# EasyEDA Pro project 学期项目.epro, board PCB1_1
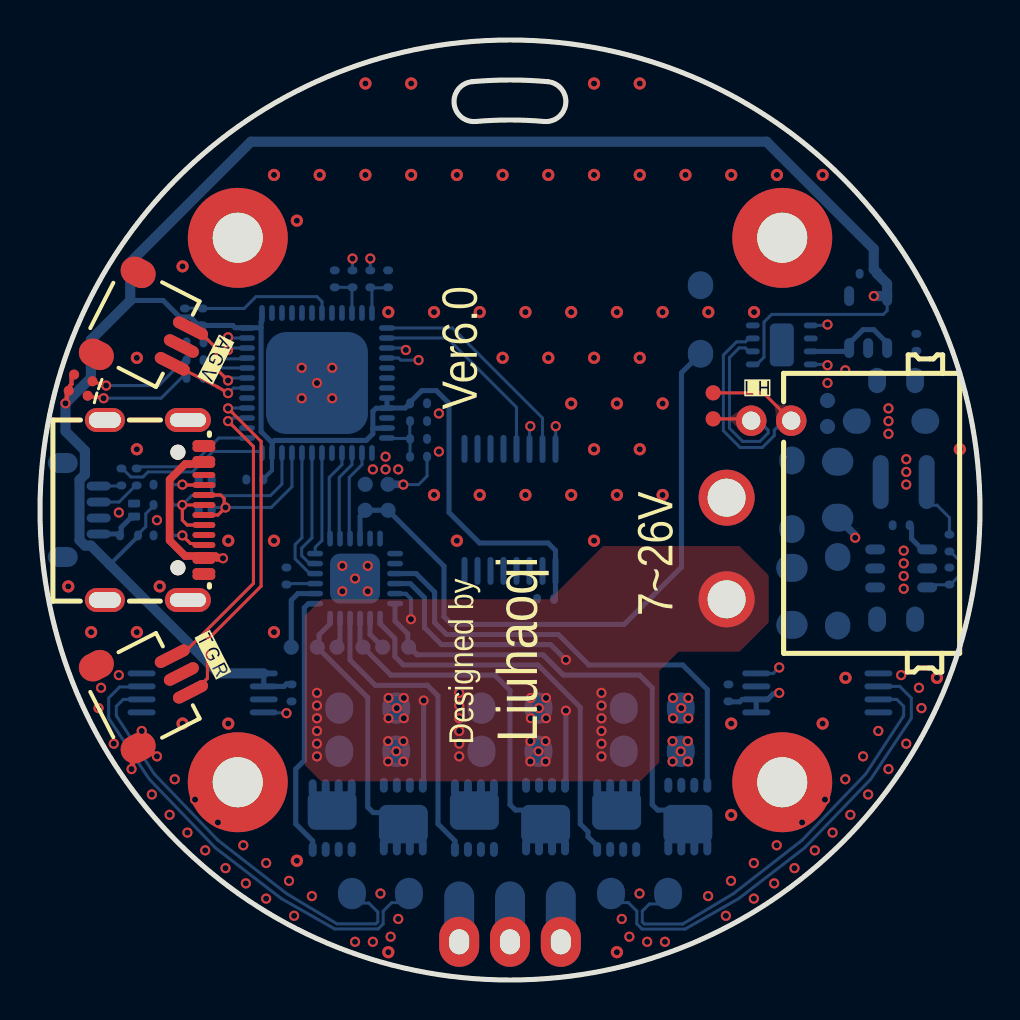
[diagram p13: board, top side]
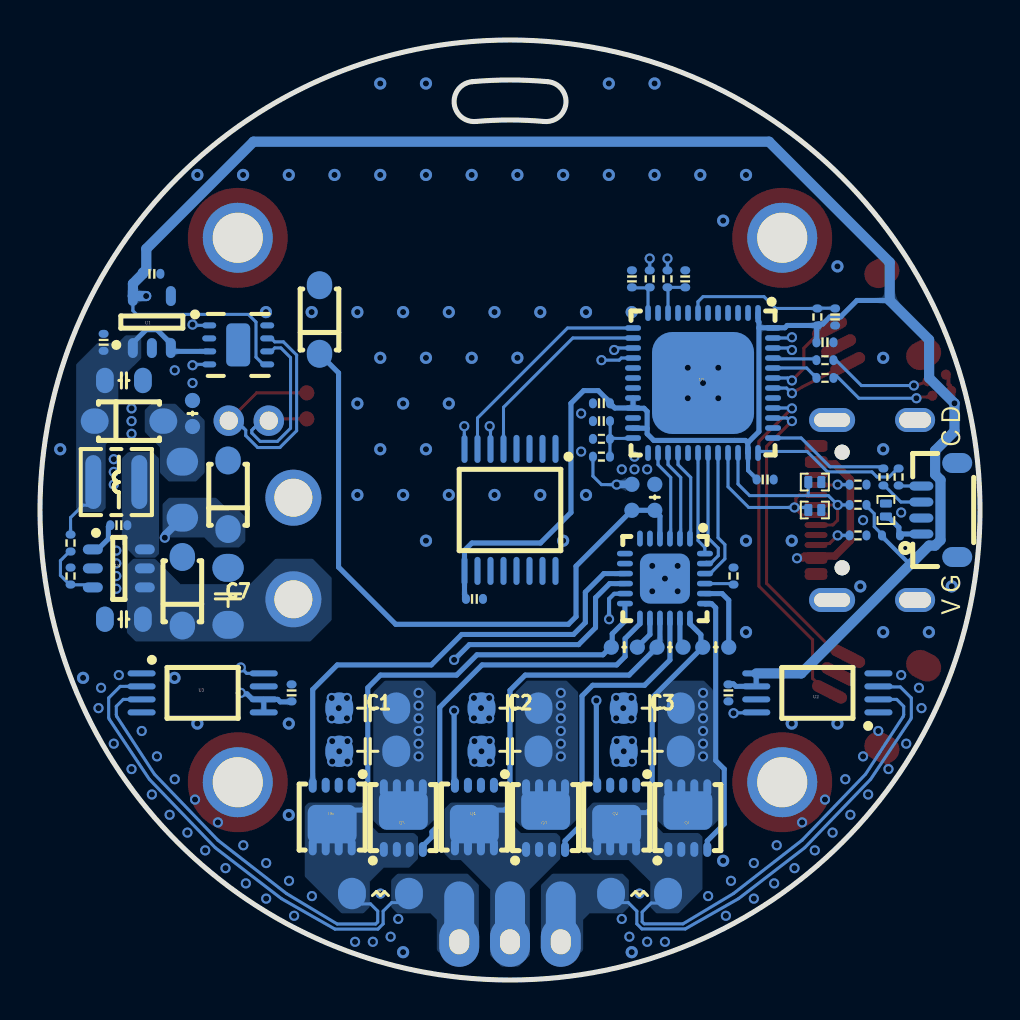
[diagram p14: board, bottom side, seen from below]

Outline 47 x 47 mm; copper layers: Top Layer, PowerAndSingle, Ground, Bottom Layer. Coordinates in mm from the lower left corner of the outline.
Outline path: circle c23.5,23.5 r23.5 ; 21.63,44.92 arc(23.5,45) 25.37,44.92 arc(26.3,43.83) 25.2,42.93 arc(23.5,43) 21.8,42.93 arc(20.7,43.83) 21.63,44.92
Stack: Top Layer 0.035mm / Dielectric 2 0.0994mm PP-006 er 4.1 / PowerAndSingle 0.0152mm / Dielectric 1 0.7mm FR-4 er 4.8 / Ground 0.0152mm / Dielectric 3 0.0994mm PP-006 er 4.1 / Bottom Layer 0.035mm

## Design rules (mm)
net VBAT: POWER
net +5: POWER
net +3.3: POWER
net VBUS: POWER
spacing Clearance (default): track to track 0.102, other pairs 0.102 to 0.3
track width Width (default): min 0.102, default 0.254, max 7.62
differential pair DiffPairsRouting (default): width min 0.102, default 0.152, max 0.381; gap min 0.102, default 0.152

## Placement (name value [footprint] x y rotation side)
C1  22UF@35V  [C1206_NS]  30.61 13.59 0 bottom
C2  22UF@35V  [C1206_NS]  23.5 13.59 0 bottom
C3  22UF@35V  [C1206_NS]  16.39 13.59 0 bottom
C4  22UF@35V  [C1206_NS]  30.61 11.44 0 bottom
C5  22UF@35V  [C1206_NS]  16.39 11.44 0 bottom
C6  22UF@35V  [C1206_NS]  23.5 11.44 0 bottom
C7  22UF@35V  [C1206_NS]  37.6 19.18 90 bottom
C8  1UF  [C0402_NS]  43.82 31.88 270 bottom
C9  1UF  [C0402_NS]  41.41 35.31 0 bottom
C10  0.1UF  [C0402_NS]  12.58 14.36 90 bottom
C11  0.1UF  [C0402_NS]  34.42 14.36 270 bottom
C12  1UF  [C0603_NS]  13.21 16.64 180 bottom
C13  0.1UF  [C0402_NS]  43.06 22.74 180 bottom
C14  10UF  [C0805_NS]  42.8 29.98 0 bottom
C15  4.7UF@35V  [C0805_NS]  42.8 18.04 180 bottom
C16  10UF@25V  [C0603_NS]  16.26 24.13 270 bottom
C17  0.1UF  [C0402_NS]  10.74 25.02 180 bottom
C18  1UF  [C0603_NS]  15.5 16.64 180 bottom
C19  0.1UF  [C0402_NS]  7.75 31.88 180 bottom
C20  0.1UF  [C0402_NS]  18.93 28.83 0 bottom
C21  0.1UF  [C0402_NS]  14.74 35.06 270 bottom
C22  0.1UF  [C0402_NS]  18.93 27.94 0 bottom
C23  0.1UF  [C0402_NS]  17.4 35.06 90 bottom
C24  1UF  [C0603_NS]  17.78 16.64 180 bottom
C25  0.1UF  [C0402_NS]  7.24 33.15 90 bottom
C26  1UF  [C0603_NS]  39.38 28.33 270 bottom
C27  0.1UF  [C0402_NS]  25.28 19.05 0 bottom
D1  SMF26A  [SOD-123]  39.88 19.44 270 bottom
D2  MM1Z20  [SOD-123]  33.03 33.02 270 bottom
D3  PESD5V0F1BL  [DFN1006-2L_L1.0_W0.6_P0.7]  4.7 23.5 90 bottom
D4  K24  [SOD-123]  42.55 27.94 0 bottom
D5  SMF6CA  [SOD-123]  37.6 24.26 270 bottom
D6  PESD5V0F1BL  [DFN1006-2L_L1.0_W0.6_P0.7]  8.26 23.5 180 bottom
D7  PESD5V0F1BL  [DFN1006-2L_L1.0_W0.6_P0.7]  8.26 24.9 180 bottom
JP1  CON-3P  [SH1.0-WT-3P]  5.47 14.48 297 top
JP2  CON-3P  [SH1.0-WT-3P]  5.47 32.52 243 top
JP3  CON-4P  [HC0.8-WT-4P]  2.04 23.5 90 bottom
L1  10uH  [NR3015]  43.19 24.9 0 bottom
L2  22nH@0.5A  [L0402_NS]  4.45 22.23 180 bottom
L3  1uH@1A  [L1206_NS]  39.88 24.52 90 bottom
LED1  绿色  [LED0402_NS]  2.16 30.1 340 top
LED2  红色  [LED0402_NS]  1.91 29.34 345 top
NOREF  -  [Pad_e57]  23.5 3.18 0 top
NOREF#2  -  [Pad_e63]  37.11 37.11 180 top
NOREF#3  -  [Pad_e55]  26.04 3.18 0 top
NOREF#4  -  [Pad_e64]  9.89 37.11 270 top
NOREF#5  -  [Pad_e58]  37.11 9.89 90 top
NOREF#6  -  [Pad_e62]  9.89 9.89 0 top
NOREF#7  -  [Pad_e66]  26.04 1.91 0 top
NOREF#8  -  [Pad_e68]  23.5 1.91 0 top
NOREF#9  -  [Pad_e59]  9.89 9.89 0 top
NOREF#10  -  [Pad_e61]  37.11 37.11 180 top
NOREF#11  -  [Pad_e67]  20.96 1.91 0 top
NOREF#12  -  [Pad_e60]  9.89 37.11 270 top
NOREF#13  -  [Pad_e56]  20.96 3.18 0 top
NOREF#14  -  [Pad_e65]  37.11 9.89 90 top
P1  XT30(2+2)  [XT30(2+2)PW-M]  35.95 23.5 90 top
Q1  AON7544  [DFN8_L3.3_W3.3_P0.65]  14.61 8.13 180 bottom
Q2  AON7544  [DFN8_L3.3_W3.3_P0.65]  18.17 8.13 0 bottom
Q3  AON7544  [DFN8_L3.3_W3.3_P0.65]  21.72 8.13 180 bottom
Q4  AON7544  [DFN8_L3.3_W3.3_P0.65]  25.28 8.13 0 bottom
Q5  AON7544  [DFN8_L3.3_W3.3_P0.65]  28.83 8.13 180 bottom
Q6  AON7544  [DFN8_L3.3_W3.3_P0.65]  32.39 8.13 0 bottom
R1  50mR  [R1206_NS]  17.02 4.32 0 bottom
R2  50mR  [R1206_NS]  29.98 4.32 0 bottom
R3  40K/NC  [R0402_NS]  12.32 20.2 90 bottom
R4  120R/NC  [R0603_NS]  33.66 28.71 90 top
R5  2K  [R0402_NS]  45.47 20.2 90 bottom
R6  10K  [R0402_NS]  45.47 21.85 270 bottom
R7  510R  [R0603_NS]  17.4 24.13 270 bottom
R8  75K  [R0402_NS]  18.93 26.17 0 bottom
R9  100R  [R0402_NS]  15.63 35.06 90 bottom
R10  10K  [R0402_NS]  18.93 27.06 180 bottom
R11  100R  [R0402_NS]  16.52 35.06 90 bottom
R12  10K  [R0402_NS]  8.13 33.15 270 bottom
R13  5.1K  [R0402_NS]  7.75 30.99 180 bottom
R14  2K  [R0402_NS]  7.75 30.1 180 bottom
R15  100R  [R0402_NS]  4.83 25.15 270 bottom
R16  100R  [R0402_NS]  4.07 25.15 270 bottom
R17  5.1K  [R0402_NS]  6.1 24.77 0 bottom
R18  5.1K  [R0402_NS]  6.1 22.23 0 bottom
R19  1.5K  [R0402_NS]  6.1 23.75 180 bottom
U1  LN1134A332MR  [SOT23-5_L3.0_W1.7_P0.95]  41.41 32.9 90 bottom
U2  INA240A1  [TSSOP8_L4.4_W3.0_P0.65]  8.13 14.36 0 bottom
U3  INA240A1  [TSSOP8_L4.4_W3.0_P0.65]  38.87 14.36 180 bottom
U4  RY8411  [SOT23-6_L3.0_W1.7_P0.95]  43.06 20.58 180 bottom
U5  DRV8300D  [QFN24_L4.0_W4.0_P0.5]  15.75 20.07 0 bottom
U6  SIT1051ATK/3  [DFN8_L3.0_W3.0_P0.65]  37.09 31.75 270 bottom
U7  STM32G431CBU6  [QFN48_L7.0_W7.0_P0.5]  13.85 29.85 0 bottom
U8  MT6826S  [TSSOP16_L5.0_W4.4_P0.65]  23.5 23.5 270 bottom
USB1  USB_Type-C_16P_F  [USB_Type-C_SMD_16P_F]  5.72 23.5 90 top

## Footprints (pads in the part's own frame, mm; a bottom-side part is the same pattern mirrored in y, then rotated)
C0402_NS
  rrect 0.4x0.5 smd: 1(-0.425,0) 2(0.425,0)
C0603_NS
  rrect 0.762x0.762 smd: 1(-0.65,0) 2(0.65,0)
C0805_NS
  rrect 0.889x1.27 smd: 1(-0.95,0) 2(0.95,0)
C1206_NS
  rrect 1.397x1.575 smd: 1(-1.425,0) 2(1.425,0)
DFN8_L3.0_W3.0_P0.65
  rrect 0.3x0.7 smd: 1(-0.975,-1.45) 2(-0.325,-1.45) 3(0.325,-1.45) 4(0.975,-1.45) 5(0.975,1.45) 6(0.325,1.45) 7(-0.325,1.45) 8(-0.975,1.45)
  rrect 2.15x1.2 smd: 9(0,0)
DFN8_L3.3_W3.3_P0.65
  rrect 0.402x0.75 smd: 1(-0.975,-1.605) 2(-0.325,-1.605) 3(0.325,-1.605) 4(0.975,-1.605)
  rrect 0.402x0.856 smd: 5(-0.975,1.478) 6(-0.325,1.478) 7(0.325,1.478) 8(0.975,1.478)
  rrect 2.449x1.928 smd: 9(0.003,0.341)
DFN1006-2L_L1.0_W0.6_P0.7
  rrect 0.4x0.6 smd: 1(-0.325,0) 2(0.325,0)
HC0.8-WT-4P
  rrect 1x1.5 smd: 0(-2.35,-0.898) 0(2.35,-0.898)
  rrect 0.45x1.208 smd: 1(-1.2,0.898) 2(-0.4,0.898) 3(0.4,0.898) 4(1.2,0.898)
L0402_NS
  rrect 0.4x0.5 smd: 1(-0.45,0) 2(0.45,0)
L1206_NS
  rrect 1.397x1.575 smd: 1(-1.4,0) 2(1.4,0)
LED0402_NS
  rrect 0.508x0.508 smd: 1(-0.488,0) 2(0.488,0)
NR3015
  rrect 0.8x2.7 smd: 1(-1.15,0) 2(1.15,0)
Pad_e55
  oval 1.5x3.5 smd far side: 6(0,0)
Pad_e56
  oval 1.5x3.5 smd far side: 6(0,0)
Pad_e57
  oval 1.5x3.5 smd far side: 6(0,0)
Pad_e58
  round 5 smd: AA23(0,0)
Pad_e59
  round 5 smd: AA23(0,0)
Pad_e60
  round 5 smd: AA23(0,0)
Pad_e61
  round 5 smd: AA23(0,0)
Pad_e62
  round 3.5 hole 2.505: AA22(0,0)
Pad_e63
  round 3.5 hole 2.505: AA22(0,0)
Pad_e64
  round 3.5 hole 2.505: AA22(0,0)
Pad_e65
  round 3.5 hole 2.505: AA22(0,0)
Pad_e66
  oval 2x2.5 hole 1x1.25: 7(0,0)
Pad_e67
  oval 2x2.5 hole 1x1.25: 7(0,0)
Pad_e68
  oval 2x2.5 hole 1x1.25: 7(0,0)
QFN24_L4.0_W4.0_P0.5
  rrect 0.28x0.8 smd: 1(-1.25,-2) 2(-0.75,-2) 3(-0.25,-2) 4(0.25,-2) 5(0.75,-2) 6(1.25,-2) 13(1.25,2) 14(0.75,2) 15(0.25,2) 16(-0.25,2) 17(-0.75,2) 18(-1.25,2)
  rrect 0.8x0.28 smd: 7(2,-1.25) 8(2,-0.75) 9(2,-0.25) 10(2,0.25) 11(2,0.75) 12(2,1.25) 19(-2,1.25) 20(-2,0.75) 21(-2,0.25) 22(-2,-0.25) 23(-2,-0.75) 24(-2,-1.25)
  rrect 2.5x2.5 smd: 25(0,0)
QFN48_L7.0_W7.0_P0.5
  rrect 0.28x0.8 smd: 1(-2.75,-3.5) 2(-2.25,-3.5) 3(-1.75,-3.5) 4(-1.25,-3.5) 5(-0.75,-3.5) 6(-0.25,-3.5) 7(0.25,-3.5) 8(0.75,-3.5) 9(1.25,-3.5) 10(1.75,-3.5) 11(2.25,-3.5) 12(2.75,-3.5) 25(2.75,3.5) 26(2.25,3.5) 27(1.75,3.5) 28(1.25,3.5) 29(0.75,3.5) 30(0.25,3.5) 31(-0.25,3.5) 32(-0.75,3.5) 33(-1.25,3.5) 34(-1.75,3.5) 35(-2.25,3.5) 36(-2.75,3.5)
  rrect 0.8x0.28 smd: 13(3.5,-2.75) 14(3.5,-2.25) 15(3.5,-1.75) 16(3.5,-1.25) 17(3.5,-0.75) 18(3.5,-0.25) 19(3.5,0.25) 20(3.5,0.75) 21(3.5,1.25) 22(3.5,1.75) 23(3.5,2.25) 24(3.5,2.75) 37(-3.5,2.75) 38(-3.5,2.25) 39(-3.5,1.75) 40(-3.5,1.25) 41(-3.5,0.75) 42(-3.5,0.25) 43(-3.5,-0.25) 44(-3.5,-0.75) 45(-3.5,-1.25) 46(-3.5,-1.75) 47(-3.5,-2.25) 48(-3.5,-2.75)
  rrect 5.1x5.1 smd: 49(0,0)
R0402_NS
  rrect 0.4x0.5 smd: 1(-0.425,0) 2(0.425,0)
R0603_NS
  rrect 0.762x0.762 smd: 1(-0.65,0) 2(0.65,0)
R1206_NS
  rrect 1.397x1.575 smd: 1(-1.425,0) 2(1.425,0)
SH1.0-WT-3P
  rrect 1.4x1.8 smd: 0(-2.3,-1.8) 0(2.3,-1.8)
  rrect 0.6x1.9 smd: 1(1,1.8) 2(0,1.8) 3(-1,1.8)
SOD-123
  rrect 1.397x1.27 smd: 1(-1.714,0) 2(1.714,0)
SOT23-5_L3.0_W1.7_P0.95
  rrect 1x0.5 smd: 1(-1.3,0.95) 2(-1.3,0) 3(-1.3,-0.95) 4(1.3,-0.95) 5(1.3,0.95)
SOT23-6_L3.0_W1.7_P0.95
  rrect 1x0.5 smd: 1(-1.3,0.95) 2(-1.3,0) 3(-1.3,-0.95) 4(1.3,-0.95) 5(1.3,0) 6(1.3,0.95)
TSSOP8_L4.4_W3.0_P0.65
  oval 1.4x0.3 smd: 1(-3.054,0.975) 2(-3.054,0.325) 3(-3.054,-0.325) 4(-3.054,-0.975) 5(3.054,-0.975) 6(3.054,-0.325) 7(3.054,0.325) 8(3.054,0.975)
TSSOP16_L5.0_W4.4_P0.65
  oval 1.4x0.3 smd: 1(-3.054,2.275) 2(-3.054,1.625) 3(-3.054,0.975) 4(-3.054,0.325) 5(-3.054,-0.325) 6(-3.054,-0.975) 7(-3.054,-1.625) 8(-3.054,-2.275) 9(3.046,-2.275) 10(3.046,-1.625) 11(3.046,-0.975) 12(3.046,-0.325) 13(3.046,0.325) 14(3.046,0.975) 15(3.046,1.625) 16(3.046,2.275)
USB_Type-C_SMD_16P_F
  round 0.75 hole 0.75: (-2.89,-1.175) (2.89,-1.175)
  oval 1.2x2 hole 0.8x1.6: 0(-4.5,2.475) 0(4.5,2.475)
  oval 1.2x2.3 hole 0.7x1.8: 0(-4.5,-1.675) 0(4.5,-1.675)
  rrect 0.4x1.15 smd: A1(3.3,-2.474) A4(2.5,-2.47) A9(-2.5,-2.475) A12(-3.3,-2.475) B1(-3.1,-2.475) B4(-2.3,-2.475) B9(2.3,-2.47) B12(3.1,-2.474)
  rrect 0.3x1.15 smd: A5(1.25,-2.475) A6(0.25,-2.475) A7(-0.25,-2.474) B5(-1.75,-2.475) B6(-0.75,-2.475) B7(0.75,-2.473)
  rrect 0.299x1.148 smd: A8(1.75,-2.474) B8(-1.25,-2.475)
XT30(2+2)PW-M
  round 2.8 hole 1.9: 1(-4.465,1.615) 2(0.615,1.615)
  round 1.524 hole 0.914: 3(4.465,0.385) 4(4.465,-1.615)

## Nets
As in the schematic, except:
GND: C1.2 C2.2 C3.2 C4.2 C5.2 C6.2 C7.2 C8.1 C9.1 C10.1 C11.1 C14.1 C15.1 C16.1 C17.2 C19.2 C20.2 C21.1 C22.2 C23.2 C25.1 C26.1 C27.1 D1.1 D2.1 D3.2 D5.1 D6.2 D7.2 JP1.0 JP1.2 JP2.0 JP2.2 JP3.0 JP3.2 NOREF#2.AA22 NOREF#4.AA22 NOREF#5.AA23 NOREF#6.AA22 NOREF#9.AA23 NOREF#10.AA23 NOREF#12.AA23 NOREF#14.AA22 P1.2 Q2.1 Q2.2 Q2.3 Q4.1 Q4.2 Q4.3 Q6.1 Q6.2 Q6.3 R3.2 R5.2 R10.1 R17.1 R18.1 U1.2 U2.4 U2.7 U3.4 U3.7 U4.2 U5.6 U5.25 U6.2 U6.8 U6.9 U7.49 U8.4 U8.12 USB1.0 USB1.A1 USB1.A12 USB1.B1 USB1.B12
I_SENSE_U: C12.1 Q5.1 Q5.2 Q5.3 Q6.5 Q6.6 Q6.7 Q6.8 Q6.9 R1.1 U2.2 U5.18
I_SENSE_W: C24.1 Q1.1 Q1.2 Q1.3 Q2.5 Q2.6 Q2.7 Q2.8 Q2.9 R2.2 U3.3 U5.12
LO1: Q6.4 U5.11
LO3: Q2.4 U5.9
MOTOR_U: NOREF#11.7 NOREF#13.6 R1.2 U2.3
MOTOR_V: C18.1 NOREF.6 NOREF#8.7 Q3.1 Q3.2 Q3.3 Q4.5 Q4.6 Q4.7 Q4.8 Q4.9 U5.15
MOTOR_W: NOREF#3.6 NOREF#7.7 R2.1 U3.2
SPI_CSN: U7.16 U8.8
$1N181: Q5.4 U5.19
$1N183: Q1.4 U5.13

Pads without a net: U1 4; U2 1; U3 1; U5 5 7 8; U7 2 3 4 5 6 8 9 11 17 18 19 22 25 29 38 41; U8 1 2 3 10 11 13 14 15 16; USB1 A8 B8

## Via types
v1: diameter 0.508, hole 0.305, Top Layer to Bottom Layer, 164 vias
v2: diameter 0.61, hole 0.305, Top Layer to Bottom Layer, 65 vias

## Routing (per net, layer and track width the routed paths; a pad name or vN(x,y) marks a point on that pad's centre or on a via; arc(x,y) is an arc through that point)
GND: length 2.3
  Top Layer w0.254: v1(5.85,11.18) 5.78,11.18 5.34,11.62 JP1.0 4.63,11.34 4.63,10.59 v1(4.58,10.55)
  vias: v1(2.93,13.59) v1(3.05,14.61) v1(3.69,11.82) v1(3.94,23.37) v1(3.94,15.24) v1(5.09,12.45) v1(5.59,9.28) v1(5.85,22.99) v1(6.48,8.26) v1(6.74,10.04) v1(7.37,7.37) v1(7.75,9.02) v1(8.26,6.48) v1(8.9,7.88) v1(9.28,5.59) v1(10.16,6.74) v1(10.29,4.83) v1(11.31,5.85) v1(11.31,4.07) v1(12.45,4.96) v1(12.71,3.21) v1(13.09,30.61) v1(13.09,29.09) v1(13.59,4.2) v1(13.85,29.85) v1(14.61,30.61) v1(14.61,29.09) v1(15.12,20.71) v1(15.12,19.44) v1(15.75,20.07) v1(15.75,1.91) v1(16.39,20.71) v1(16.39,19.44) v1(16.64,25.53) v1(16.64,1.91) v1(17.02,4.32) v1(17.28,26.17) v1(17.28,25.53) v1(17.43,14.1) v1(17.43,13.09) v1(17.4,11.94) v1(17.4,10.93) v1(17.53,2.16) v1(17.84,13.59) v1(17.81,11.44) v1(17.91,25.53) v1(17.91,3.05) v1(18.19,14.1) v1(18.19,13.09) v1(18.17,11.94) v1(18.17,10.93) v1(19.94,28.33) v1(19.94,26.42) v1(24.54,14.1) v1(24.54,13.09) v1(24.52,11.94) v1(24.52,10.93) v1(24.95,13.59) v1(24.93,11.44) v1(25.3,14.1) v1(25.3,13.09) v1(25.28,11.94) v1(25.28,10.93) v1(29.09,3.05) v1(29.47,2.16) v1(29.98,4.32) v1(30.36,1.91) v1(31.25,1.91) v1(31.65,14.1) v1(31.65,13.09) v1(31.63,11.94) v1(31.63,10.93) v1(32.04,11.44) v1(32.06,13.59) v1(32.41,14.1) v1(32.41,13.09) v1(32.39,11.94) v1(32.39,10.93) v1(33.41,4.2) v1(34.29,3.21) v1(34.55,4.96) v1(35.69,5.85) v1(35.69,4.07) v1(36.71,4.83) v1(36.84,6.74) v1(37.72,5.59) v1(38.1,7.88) v1(38.74,6.48) v1(39.25,9.02) v1(39.38,29.85) v1(39.63,7.37) v1(40.26,30.48) v1(40.26,10.04) v1(40.52,8.26) v1(41.15,11.18) v1(41.41,9.28) v1(41.91,12.45) v1(42.42,28.58) v1(42.42,27.94) v1(42.42,27.31) v1(42.42,10.55) v1(43.06,15.24) v1(43.19,21.47) v1(43.19,20.83) v1(43.19,20.2) v1(43.19,19.56) v1(43.31,26.04) v1(43.31,25.41) v1(43.31,24.77) v1(43.31,11.82) v1(43.95,14.61) v1(44.07,13.59) v2(1.41,19.68) v2(2.56,17.39) v2(4.84,31.11) v2(4.84,26.54) v2(4.84,17.39) v2(5.99,19.68) v2(7.13,35.68) v2(7.13,12.82) v2(9.41,21.96) v2(9.41,12.82) v2(11.7,40.25) v2(11.7,21.96) v2(11.7,17.39) v2(12.84,37.97) v2(12.84,5.96) v2(13.99,40.25) v2(16.27,44.83) v2(16.27,40.25) v2(17.41,33.39) v2(17.41,1.39) v2(18.56,44.83) v2(18.56,40.25) v2(19.7,33.39) v2(19.7,24.25) v2(20.84,40.25) v2(20.84,21.96) v2(21.99,33.39) v2(21.99,24.25) v2(23.13,40.25) v2(23.13,31.11) v2(24.27,33.39) v2(24.27,24.25) v2(25.42,40.25) v2(25.42,31.11) v2(26.56,33.39) v2(26.56,28.82) v2(26.56,24.25) v2(27.7,44.83) v2(27.7,40.25) v2(27.7,31.11) v2(27.7,26.54) v2(27.7,21.96) v2(28.84,33.39) v2(28.84,28.82) v2(28.84,24.25) v2(28.84,1.39) v2(29.99,44.83) v2(29.99,40.25) v2(29.99,31.11) v2(29.99,26.54) v2(31.13,33.39) v2(31.13,28.82) v2(31.13,24.25) v2(32.27,40.25) v2(33.42,33.39) v2(34.56,40.25) v2(34.56,12.82) v2(34.56,8.25) v2(35.7,33.39) v2(36.85,40.25) v2(39.13,40.25) v2(39.13,12.82) v2(40.28,15.11) v2(44.85,15.11) v2(45.99,26.54)
VBAT: length 9.4
  PowerAndSingle w0.381: v1(18.17,24.77) 17.4,24.01 17.4,18.82
  Bottom Layer w0.152: R8.2 19.35,25.19 18.93,24.77 v1(18.17,24.77)
  Bottom Layer w0.381: v1(18.17,24.77) 18.15,24.78 R7.1
  vias: v1(13.85,14.36) v1(13.85,13.72) v1(13.85,13.09) v1(13.85,12.45) v1(13.85,11.82) v1(13.85,11.18) v1(20.96,14.36) v1(20.96,13.72) v1(20.96,13.09) v1(20.96,12.45) v1(20.96,11.82) v1(20.96,11.18) v1(28.07,14.36) v1(28.07,13.72) v1(28.07,13.09) v1(28.07,12.45) v1(28.07,11.82) v1(28.07,11.18)
VBUS: length 58.6
  Top Layer w0.381: 8.2,25.81 USB1.B9 7.26,25.8 6.48,25.02 6.48,21.98 7.26,21.2 USB1.B4 8.2,21.19 8.78,21.19 8.86,21.11 9.12,21.11 v1(9.15,21.09)
  PowerAndSingle w0.381: v1(9.15,21.09) 9.15,13.97 13.97,9.15 33.03,9.15 40.76,16.88 v1(40.76,22.11)
  Bottom Layer w0.381: 39.88,23.12 39.89,23.12 40.74,22.27 40.74,22.14 v1(40.76,22.11)
+3.3: length 158.1
  Top Layer w0.203: LED1.1 1.58,30.14 1.58,29.79 1.5,29.71 LED2.1 1.34,29.37 1.34,28.98 1.28,28.92 v1(1.28,28.83)
  PowerAndSingle w0.508: v1(41.69,34.2) 41.69,30.77 39.88,28.96 39.88,17.28 v1(36.96,14.36)
  Bottom Layer w0.152: U1.5 42.36,33.47 42.17,33.28 36.58,33.28 36.2,32.9 36.2,31.14 35.84,30.78 U6.5 ; 4.9,22.28 5.29,22.67 5.29,23.32 5.68,23.7 R19.2
  Bottom Layer w0.203: 3.5,20.77 3.5,20.78 4.9,22.18 L2.1 ; U7.35 11.6,25.48 11.19,25.07 11.19,25.02
  Bottom Layer w0.254: R12.2 8.06,32.8 7.86,32.8 7.51,33.15 6.99,33.15 6.97,33.17 6.96,33.17 6.15,33.98 4.51,33.98 ; R12.2 8.17,32.69 8.17,31.92 8.2,31.88 ; R12.2 9.64,32.73 9.75,32.61 10.34,32.61 ; U7.1 11.1,32.95 11.05,32.91 11.05,32.61 ; v1(36.96,14.36) 36.91,14.31 36.65,14.31 36.38,14.03 U3.6 ; 11.61,26.86 11.61,26.36 U7.35 ; 11.61,26.86 11.05,27.42 11.05,32.61 ; 11.61,26.86 11.73,26.98 16.31,26.98 16.64,27.31 16.64,27.56 ; 25.73,19.05 25.78,19.1 U8.9 25.78,21.48 25.41,21.85 21.98,21.85 20.45,23.37 20.45,28.83 19.82,29.47 19.09,29.47 18.5,28.88 C20.1 18.5,28.78 18.43,28.71 18.37,28.71 18.26,28.6 U7.21 ; U7.21 U7.20 ; U7.21 17.34,28.59 16.8,28.59 16.64,28.43 16.64,27.56 ; U2.5 U2.6 12.2,14.68 12.33,14.81 12.58,14.81 ; 16.64,27.56 16.66,27.59 17.34,27.59 U7.23 ; U3.6 35.11,14.03 34.99,13.91 34.42,13.91 ; U3.6 U3.5 ; 11.05,32.61 10.36,32.61 U7.48
  Bottom Layer w0.508: v1(41.69,34.2) U1.5 42.35,34.2 42.35,34.81 41.86,35.31 41.86,35.36 41.69,35.53 41.69,36.56 36.33,41.91 10.55,41.91 4.51,35.88 4.51,33.98 2.55,32.01 2.55,30.1 v1(1.28,28.83) 1.28,27.44 2.24,26.47 2.24,25.28 1.98,25.01 1.98,21.99 2.25,21.72 2.55,21.72 8.94,15.33 U2.5
+5: length 8.2
  Bottom Layer w0.152: R6.1 45.47,23.12 44.85,23.74 44.65,23.74 44.34,24.05 L1.2
  Bottom Layer w0.254: U1.1 42.36,31.85 41.69,32.52 41.15,32.52 40.61,31.97 40.58,31.97 40.46,31.85 40.46,31.55 40.33,31.43 U6.3
CAN_H: length 14.5
  Top Layer w0.152: R4.2 36.17,29.36 P1.4
  Bottom Layer w0.152: P1.4 37.19,27.96 36.82,27.59 36.82,27.59 36.71,27.49 36.71,27.22 36.12,26.62 35.01,26.62 34.17,27.46 34.17,31.25 34.83,31.91 35.27,31.91 35.44,32.08 U6.7
CAN_L: length 10.5
  Top Layer w0.152: R4.1 35.47,28.06 P1.3
  Bottom Layer w0.152: P1.3 35.93,27.96 36.3,27.59 36.31,27.59 36.41,27.49 36.41,27.35 35.99,26.93 35.13,26.93 34.47,27.59 34.47,31.12 34.95,31.6 35.27,31.6 35.44,31.43 U6.6
CAN_R: length 37
  PowerAndSingle w0.152: v1(39.38,30.74) 32.77,37.34 15.25,37.34 v1(9.4,31.5)
  Bottom Layer w0.152: U6.4 39.33,30.78 v1(39.38,30.74) ; U7.46 9.6,31.6 9.5,31.5 v1(9.4,31.5)
CAN_T: length 36.2
  PowerAndSingle w0.152: v1(9.4,32.14) 14.99,37.72 33.03,37.72 37.99,32.77 v1(39.38,32.77)
  Bottom Layer w0.152: U7.47 9.44,32.1 v1(9.4,32.14) ; v1(39.38,32.77) 39.33,32.73 U6.1
CC1: length 1.7
  Top Layer w0.152: USB1.A5 7.14,24.75 v1(7.12,24.77)
  Bottom Layer w0.152: R17.2 v1(7.12,24.77)
CC2: length 1.9
  Top Layer w0.152: v1(7.12,22.23) 7.52,21.82 8.12,21.82 USB1.B5
  Bottom Layer w0.152: R18.2 v1(7.12,22.23)
DM: length 9
  Top Layer w0.152: USB1.B7 9.03,24.25 9.21,24.08 9.21,23.69 v1(9.28,23.63) 8.9,23.25 USB1.A7
  Bottom Layer w0.152: D6.1 8.59,23.5 8.71,23.63 v1(9.28,23.63) 11.56,23.63 12.6,24.66 U7.33
DP: length 11.2
  Top Layer w0.152: USB1.B6 7.36,22.75 7.12,22.99 v1(7.12,23.75) 7.12,23.75 USB1.A6
  Bottom Layer w0.152: R19.1 v1(7.12,23.75) 7.58,24.22 11.52,24.22 12.1,24.8 U7.34 ; 8.59,24.27 D7.1
HIN1: length 6.7
  Bottom Layer w0.152: U7.32 13.1,22.11 12.76,21.77 12.76,21.06 13.49,20.32 U5.22
HIN2: length 6.2
  Bottom Layer w0.152: U5.23 13.69,20.88 13.41,20.88 13.09,21.21 13.09,21.59 13.6,22.11 U7.31
HIN3: length 5.2
  Bottom Layer w0.152: U5.24 13.76,21.33 13.76,21.63 14.1,21.97 U7.30
I_SENSE_U: length 34.3
  Bottom Layer w0.152: 5.73,10.28 8.9,6.99 12.32,4.33 ; 5.71,10.31 3.84,13.17 arc(3.82,13.21) 3.81,13.27 3.81,13.68 4.16,14.03 U2.2 ; 12.33,4.32 14.85,2.81 16.79,2.81 16.89,2.91 16.89,3.4 16.44,3.85 16.07,3.85 15.6,4.32
  Bottom Layer w0.254: 18.17,7.79 17.59,8.37 16.66,8.37 16.39,8.64 16.39,14.12 C12.1 13.96,16.73 13.96,17.26 14.5,17.81 U5.18
I_SENSE_W: length 45
  Bottom Layer w0.152: 41.27,10.28 38.1,6.99 34.68,4.33 ; 41.29,10.31 43.16,13.17 arc(43.18,13.21) 43.19,13.27 43.19,13.69 42.84,14.03 U3.3 ; 34.67,4.32 32.14,2.8 30.22,2.8 30.11,2.9 30.11,3.44 30.47,3.8 30.88,3.8 R2.2
  Bottom Layer w0.254: 32.39,7.79 31.69,8.5 30.88,8.5 30.61,8.77 30.61,14.61 29.98,15.24 26.17,15.24 25.15,16.26 18.85,16.26 18.47,16.64 C24.1 18.39,16.69 18.39,17.31 17.75,17.94 U5.12
I_U: length 25.8
  PowerAndSingle w0.152: v1(15.63,36.07) 12.32,32.77 v1(12.32,13.34)
  Bottom Layer w0.152: v1(12.32,13.34) 12.3,13.36 11.21,13.36 U2.8 ; R9.2 v1(15.63,36.07)
I_W: length 41.6
  PowerAndSingle w0.152: v1(16.52,36.07) 32.01,36.07 39.12,28.96 39.12,17.78 v1(36.96,15.63)
  Bottom Layer w0.152: U3.8 36.67,15.33 v1(36.96,15.63) ; R11.2 v1(16.52,36.07)
LED_G: length 2.2
  Bottom Layer w0.152: R13.1 8.24,31.06 10.31,31.06 U7.45
LED_R: length 2.4
  Bottom Layer w0.152: U7.44 8.67,30.6 8.33,30.26 8.3,30.26 8.18,30.14 R14.1
LIN1: length 4.6
  Bottom Layer w0.152: U7.28 15.1,25.77 14.46,25.13 14.46,22.11 U5.1
LIN2: length 4.6
  Bottom Layer w0.152: U5.2 14.96,22.11 14.96,25.13 15.6,25.77 U7.27
LIN3: length 4.6
  Bottom Layer w0.152: U5.3 15.46,22.11 15.46,25.13 16.1,25.77 U7.26
LO1: length 10.5
  Ground w0.254: v1(18.55,18.04) 19.18,17.4 v1(19.18,13.97)
  Bottom Layer w0.203: U5.11 17.76,19.31 18.29,19.31 18.55,19.05 v1(18.55,18.04)
  Bottom Layer w0.254: 19.14,9.74 19.18,9.78 v1(19.18,13.97)
LO2: length 17.3
  Ground w0.254: v1(26.29,13.47) v1(26.29,16.01)
  Bottom Layer w0.254: Q4.4 26.29,9.78 v1(26.29,13.47) ; v1(26.29,16.01) 25.53,16.77 20.07,16.77 19.22,17.62 19.22,19.11 18.52,19.82 U5.10
LO3: length 23.7
  Bottom Layer w0.254: 33.37,9.74 33.37,14.52 32.14,15.75 27.44,15.75 25.91,17.28 20.32,17.28 19.73,17.87 19.73,19.39 18.81,20.32 U5.9
MOTOR_U: length 23.3
  Bottom Layer w0.152: R1.2 17.99,3.87 17.58,3.87 17.16,3.44 17.16,2.81 16.9,2.55 14.74,2.55 12.08,4.06 ; 5.48,10.03 8.76,6.62 ; U2.3 5.05,14.65 3.99,14.65 3.43,14.1 3.43,13.14 arc(3.44,13.09) 3.46,13.04 5.46,10.05 ; 8.78,6.6 12.06,4.08
MOTOR_V: length 17.6
  Bottom Layer w0.254: U5.15 16,16.79 17.55,15.24 22.74,15.24 23.5,14.48 23.5,8.77 23.77,8.5 24.58,8.5 Q4.9
MOTOR_W: length 23.3
  Bottom Layer w0.152: 41.54,10.05 43.54,13.04 arc(43.56,13.09) 43.57,13.14 43.57,14.1 42.99,14.68 U3.2 ; 38.24,6.62 41.52,10.03 ; R2.1 29.01,3.87 29.42,3.87 29.84,3.44 29.84,2.81 30.1,2.55 32.25,2.55 34.92,4.06 ; 34.94,4.08 38.22,6.6
NRST: length 7.8
  Bottom Layer w0.152: 7.24,33.6 7.26,33.59 8.12,33.59 R12.1 10.21,33.58 10.8,34.17 13.85,34.17 14.1,33.91 14.1,33.35
PWM_CH1: length 4.2
  Top Layer w0.152: JP2.1 8.87,29.66 v1(9.4,29.34)
  Bottom Layer w0.152: 10.34,29.6 9.67,29.6 9.42,29.34 v1(9.4,29.34)
PWM_CH2: length 4.6
  Top Layer w0.152: JP2.3 7.81,32.59 8.81,31.59 8.81,30.57 v1(9.4,29.98)
  Bottom Layer w0.152: v1(9.4,29.98) 9.5,29.98 9.62,30.1 U7.43
SPI_CLK: length 11.2
  Bottom Layer w0.152: U8.7 25.12,28.1 20.62,32.6 U7.13
SPI_CSN: length 11.4
  PowerAndSingle w0.152: v1(25.79,27.69) 25.28,27.18 24.26,27.18 20.45,30.99 v1(18.93,30.99)
  Bottom Layer w0.152: v1(25.79,27.69) 25.79,27.27 25.78,27.25 U8.8 ; v1(18.93,30.99) 18.04,30.99 17.93,31.1 U7.16
SPI_MISO: length 10
  Bottom Layer w0.152: U7.14 20.36,32.1 23.82,28.64 U8.5
SPI_MOSI: length 9.9
  PowerAndSingle w0.152: v1(18.29,31.5) 20.71,31.5 v1(24.52,27.69)
  Bottom Layer w0.152: U8.6 24.47,27.65 v1(24.52,27.69) ; v1(18.29,31.5) 18.2,31.5 18.1,31.6 U7.15
SWDCLK: length 6.1
  Bottom Layer w0.152: U7.37 8.94,27.1 7.5,25.66 4.91,25.66 R15.1
SWDIO: length 7.8
  Bottom Layer w0.152: R16.1 4.12,25.58 4.54,25.15 5.15,25.15 5.4,25.41 7.62,25.41 8.65,26.43 11.03,26.43 11.1,26.36 U7.36
UART_RX: length 17.4
  Top Layer w0.152: v1(9.4,28.58) 11.05,26.93 11.05,19.69 8.37,17.01 8.37,15.08 7.7,14.41 JP1.1
  Bottom Layer w0.152: v1(9.4,28.58) 9.42,28.6 U7.40
UART_TX: length 15.1
  Top Layer w0.152: v1(9.4,27.94) 10.67,26.67 10.67,19.83 7.46,16.62 JP1.3
  Bottom Layer w0.152: U7.39 9.65,28.1 9.5,27.94 v1(9.4,27.94)
VSENSE: length 3
  Bottom Layer w0.152: 18.49,27.11 18.46,27.08 17.37,27.08 U7.24 ; 18.49,27.11 18.49,27.07 R10.2 R8.1 ; 18.49,27.11 18.49,27.93 18.48,27.94
$1N166: length 3.7
  Bottom Layer w0.254: U5.20 12.9,19.32 12.56,18.99 C12.2
$1N167: length 1.7
  Bottom Layer w0.254: U4.1 44.11,21.53 43.58,22.06 43.58,22.66 43.51,22.74
$1N169: length 3.3
  Bottom Layer w0.152: R6.2 45.52,21.42 45.98,20.97 45.98,20.23 45.52,19.77 R5.1 45.46,19.76 44.49,19.76 U4.3
$1N170: length 1.5
  Bottom Layer w0.254: C18.2 15,16.8 U5.17
$1N171: length 1.7
  Bottom Layer w0.254: C24.2 16.5,17.27 U5.14
$1N172: length 33.4
  Bottom Layer w0.254: U5.4 16,23.19 16.26,23.45 C16.2 R7.2 20.2,20.69 20.2,18.17 20.58,17.78 29.22,17.78 32.07,20.64 32.07,30.36 D2.2
$1N173: length 2.2
  Bottom Layer w0.152: 14.74,34.61 14.76,34.63 R9.1 15.6,34.6 U7.10
$1N174: length 2.2
  Bottom Layer w0.152: R11.1 16.54,34.61 ; 16.54,34.61 16.6,34.55 U7.12 ; 16.54,34.61 17.4,34.61
$1N175: length 2.4
  Bottom Layer w0.254: JP3.1 3.93,22.3 L2.2 4.06,22.29 4.06,22.63 4.53,23.1 4.63,23.1 D3.1
$1N177: length 2.2
  Bottom Layer w0.152: JP3.3 3.96,23.9 4.78,24.73 R15.2
$1N178: length 1.1
  Bottom Layer w0.152: JP3.4 4.04,24.7 R16.2
$1N181: length 13.2
  Bottom Layer w0.254: 13.63,6.53 13.63,6.96 12.79,7.8 12.79,10.55 13.22,10.97 13.22,18.61 13.41,18.81 13.74,18.81 U5.19
$1N182: length 15.2
  Bottom Layer w0.254: U5.16 15.5,16 16.77,14.74 19.37,14.74 19.9,14.2 19.9,7.8 20.75,6.96 Q3.4
$1N183: length 19.7
  Bottom Layer w0.254: 17.02,17.8 17.74,17.07 17.74,16.17 18.17,15.75 24.9,15.75 27.01,13.64 27.01,7.8 27.4,7.41 27.4,7.16 27.86,6.7 27.86,6.53
$1N187: length 1.4
  Bottom Layer w0.152: R3.1 12.37,19.82 U5.21
$1N188: length 5.3
  Top Layer w0.152: LED1.2 3.05,29.78 3.11,29.72 v1(3.31,29.72)
  Bottom Layer w0.152: R13.2 7.29,30.96 7.17,30.96 5.93,29.72 v1(3.31,29.72)
$1N189: length 5.5
  Top Layer w0.152: v1(3.18,29.09) 3.12,29.15 2.63,29.15 2.38,29.22
  Bottom Layer w0.152: R14.2 7.23,30.2 7.17,30.2 6.06,29.09 v1(3.18,29.09)

## Copper pours and planes (outline as drawn; the poured copper is in the pictures)
VBAT on Top Layer: 36.33,17.91 34.93,16.52 31.88,16.52 30.87,15.5 30.87,10.93 29.98,10.04 14.1,10.04 13.34,10.8 13.34,18.17 14.1,18.93 25.53,18.93 28.2,21.59 34.93,21.59 36.33,20.2
VBAT on Bottom Layer: 20.2,14.36 20.71,14.86 22.61,14.86 23.12,14.36 23.12,8.01 22.87,7.75 20.58,7.75 20.2,8.13
VBAT on Bottom Layer: 41.28,20.96 40.01,19.69 36.45,19.69 35.18,20.96 33.41,20.96 32.52,20.07 32.52,18.04 33.53,17.02 42.17,17.02 42.55,17.4 42.55,20.71 42.3,20.96
VBAT on Bottom Layer: 27.31,14.36 27.82,14.86 29.72,14.86 30.23,14.36 30.23,8.01 29.98,7.75 27.69,7.75 27.31,8.13
VBAT on Bottom Layer: 13.09,14.1 13.85,14.86 15.5,14.86 16.01,14.36 16.01,8.01 15.75,7.75 13.47,7.75 13.09,8.13
VBAT on PowerAndSingle: 34.93,21.59 36.33,20.2 36.33,17.91 34.93,16.52 31.88,16.52 30.87,15.5 30.87,10.93 29.98,10.04 14.1,10.04 13.34,10.8 13.34,18.17 14.1,18.93 25.53,18.93 28.2,21.59
VBUS on Bottom Layer: 38.74,22.23 38.23,21.72 37.09,21.72 36.84,21.98 36.84,23.12 37.09,23.37 37.6,23.37 38.23,24.01 40.52,24.01 40.77,23.75 40.77,22.48 40.52,22.23
+5 on Bottom Layer: 42.68,32.14 43.06,31.75 44.07,31.75 45.09,30.74 45.09,23.63 44.96,23.5 43.95,23.5 43.82,23.63 43.82,26.8 43.19,27.44 43.19,29.98 42.04,31.12 42.04,32.01 42.17,32.14
I_SENSE_U on Bottom Layer: 13.97,4.58 13.97,7.12 14.1,7.24 15.88,7.24 16.26,7.62 16.26,8.64 16.39,8.77 19.31,8.77 19.56,8.51 19.56,6.35 19.31,6.1 17.53,6.1 16.39,4.96 16.39,3.69 16.13,3.43 15.12,3.43
I_SENSE_W on Bottom Layer: 33.66,5.21 31.88,3.43 30.87,3.43 30.61,3.69 30.61,4.96 29.85,5.72 28.58,5.72 28.2,6.1 28.2,7.12 28.33,7.24 30.1,7.24 30.49,7.62 30.49,8.64 30.61,8.77 33.53,8.77 33.66,8.64
MOTOR_U on Bottom Layer: 17.66,4.96 17.66,3.69 17.91,3.43 19.56,3.43 19.94,3.05 19.94,1.53 20.45,1.02 21.34,1.02 21.85,1.53 21.85,4.7 21.34,5.21 17.91,5.21
MOTOR_V on Bottom Layer: 24.39,1.27 23.88,0.77 23.12,0.77 22.61,1.27 22.61,4.58 21.09,6.1 21.09,7.12 21.21,7.24 22.99,7.24 23.37,7.62 23.37,8.64 23.5,8.77 26.42,8.77 26.68,8.51 26.68,6.35 26.42,6.1 25.91,6.1 24.39,4.58
MOTOR_W on Bottom Layer: 29.34,4.96 29.34,3.69 29.09,3.43 27.44,3.43 27.06,3.05 27.06,1.53 26.55,1.02 25.66,1.02 25.15,1.53 25.15,4.71 25.66,5.21 29.09,5.21
$1N168 on Bottom Layer: 42.8,21.85 42.17,21.21 41.28,21.21 41.15,21.34 41.15,26.04 41.41,26.29 42.55,26.29 42.8,26.04
$1N176 on Bottom Layer: 41.41,28.71 41.66,28.45 41.66,27.44 40.9,26.67 40.9,25.41 40.52,25.02 39.25,25.02 38.87,25.41 38.87,27.94 39.12,28.2 39.76,28.2 40.26,28.71

Small or netless copper shapes (teardrops, artwork), in the pictures only: 26 on Top Layer, 137 on Bottom Layer, 10 on PowerAndSingle, 4 on Ground

## Text on the board
Bottom Silkscreen Layer: C D | V G
Top Silkscreen Layer: L H | A G V | T G R | Designed by | Ver6.0 | 7~26V | Liuhaoqi | QDrive FOC
